# Altium schematic sheet SchLight.SchDoc
size A3; PageSetup: Record=PageOptions|CenterHorizontal=True|CenterVertical=True|PrintScale=0.70|XCorrection=1.00|YCorrection=1.00|PrintKind=0|BorderSize=5000000|LeftOffset=0|BottomOffset=0|Orientation=2|PaperLength=1000|PaperWidth=1000|Scale=100|PaperSource=7|PrintQuality=-4|MediaType=1|DitherType=10|PaperKind=Letter|PrintScaleMode=1
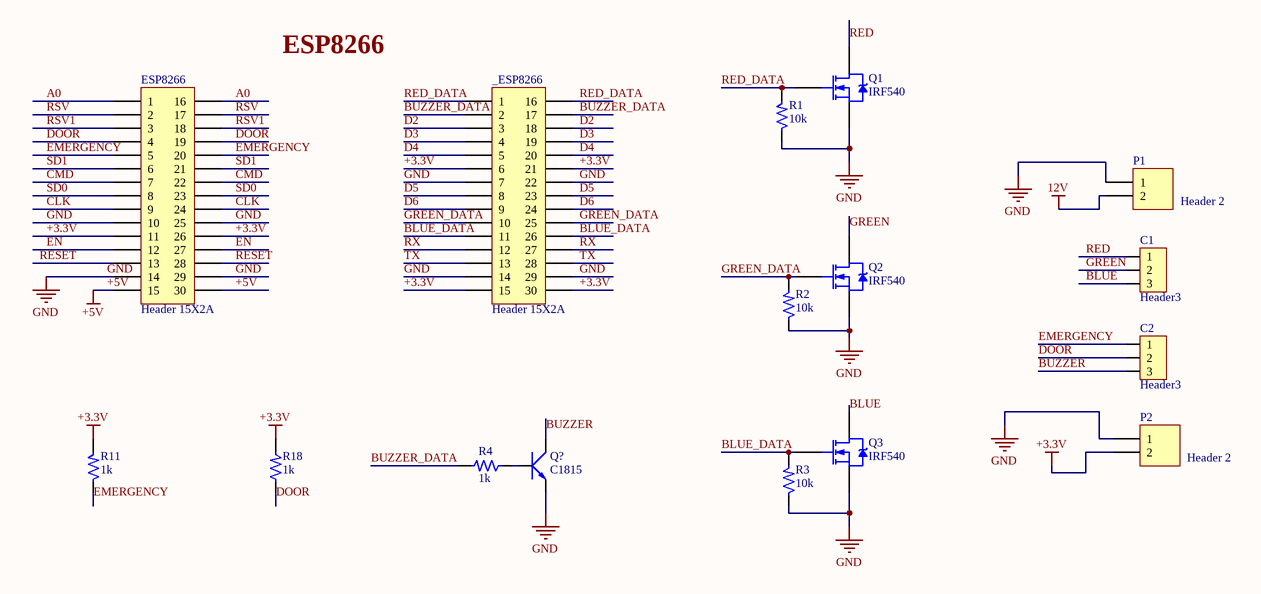
[diagram p0: SchLight.SchDoc]

## Parts
_ESP8266  Header 15X2A  [HDR2X15_CEN]
C1  Header3  [TBlock 3]
C2  Header3  [TBlock 3]
ESP8266  Header 15X2A  [HDR2X15_CEN]
P1  Header 2  [TBlock 2]
P2  Header 2  [TBlock 2]
Q1  IRF540  [TO-220-3]
Q2  IRF540  [TO-220-3]
Q3  IRF540  [TO-220-3]
Q?  C1815  [SOT23B]
R1  10k  [SM-1206]
R2  10k  [SM-1206]
R3  10k  [SM-1206]
R4  1k  [SM-1206]
R11  1k  [SM-1206]
R18  1k  [SM-1206]

## Nets
12V: P1.2
+3.3V: _ESP8266.6 _ESP8266.15 _ESP8266.21 _ESP8266.30 ESP8266.11 ESP8266.26 P2.2 R11.2 R18.2
+5V: ESP8266.15 ESP8266.30
GND: _ESP8266.7 _ESP8266.14 _ESP8266.22 _ESP8266.29 ESP8266.10 ESP8266.14 ESP8266.25 ESP8266.29 P1.1 P2.1 Q1.3(S) Q2.3(S) Q3.3(S) Q?.1(E) R1.1 R2.1 R3.1
A0: ESP8266.1 ESP8266.16
BLUE: C1.3 Q3.2(D)
BLUE_DATA: _ESP8266.11 _ESP8266.26 Q3.1(G) R3.2
BUZZER: C2.3 Q?.2(C)
BUZZER_DATA: _ESP8266.2 _ESP8266.17 R4.2
CLK: ESP8266.9 ESP8266.24
CMD: ESP8266.7 ESP8266.22
D2: _ESP8266.3 _ESP8266.18
D3: _ESP8266.4 _ESP8266.19
D4: _ESP8266.5 _ESP8266.20
D5: _ESP8266.8 _ESP8266.23
D6: _ESP8266.9 _ESP8266.24
DOOR: C2.2 ESP8266.4 ESP8266.19 R18.1
EMERGENCY: C2.1 ESP8266.5 ESP8266.20 R11.1
EN: ESP8266.12 ESP8266.27
GREEN: C1.2 Q2.2(D)
GREEN_DATA: _ESP8266.10 _ESP8266.25 Q2.1(G) R2.2
RED: C1.1 Q1.2(D)
RED_DATA: _ESP8266.1 _ESP8266.16 Q1.1(G) R1.2
RESET: ESP8266.13 ESP8266.28
RSV: ESP8266.2 ESP8266.17
RSV1: ESP8266.3 ESP8266.18
RX: _ESP8266.12 _ESP8266.27
SD0: ESP8266.8 ESP8266.23
SD1: ESP8266.6 ESP8266.21
TX: _ESP8266.13 _ESP8266.28
NetQ?_3: Q?.3(B) R4.1

## Notes on the sheet
- ESP8266

## Library data of the parts
_ESP8266 ESP8266 = Header 15X2A: Header, 15-Pin, Dual row; LatestRevisionDate: 17-Jul-2002; LatestRevisionNote: Re-released for DXP Platform.; Publisher: Altium Limited
C1 C2 = Header3: Header IDC, 3 x 1 Pin Vertical 2.54mm Pitch (Non-Boxed, Male); Manufacturer: W¨¹rth Elektronik eiSos GmbH; partNo: 613002143121; ComponentLink1 Description: Manufacturer; ComponentLink2 Description: Datasheet; NoPins: 02; Created Date: 29 March 2013; ComponentLink1URL: http://www.we-online.com; ComponentLink2URL: http://katalog.we-online.de/em/datasheet/6130xx143121.pdf; Created by: Karrer Zheng
P1 P2 = Header 2: Header, 2-Pin; LatestRevisionDate: 17-Jul-2002; LatestRevisionNote: Re-released for DXP Platform.; Publisher: Altium Limited
Q1-Q3 = IRF540: HEXFET N-Channel Power MOSFET; Note: Pin 2 is electrically connected to pin 4.; Published: 8-Jun-2000; LatestRevisionDate: 17-Jul-2002; LatestRevisionNote: Re-released for DXP Platform.; DatasheetVersion: PD-9.373H; PackageVersion: Feb-1997; PackageReference: TO-220AB; Publisher: Altium Limited; PackageDescription: TO, Thru-Hole, Vertical, Heatsink Mounted; 3 In-Line Leads; Pitch 2.54 mm; ComponentLink1Description: Manufacturer Link; ComponentLink1URL: http://www.irf.com/
Q? = C1815: NPN 600mW, ECB; Value: C1815
R1-R4 R11 R18 = R: Resistor 1/4W; Value: R1/4W - 1K